# EAGLE design tick-mini-mk-4.2 (EAGLE 6.5.0)
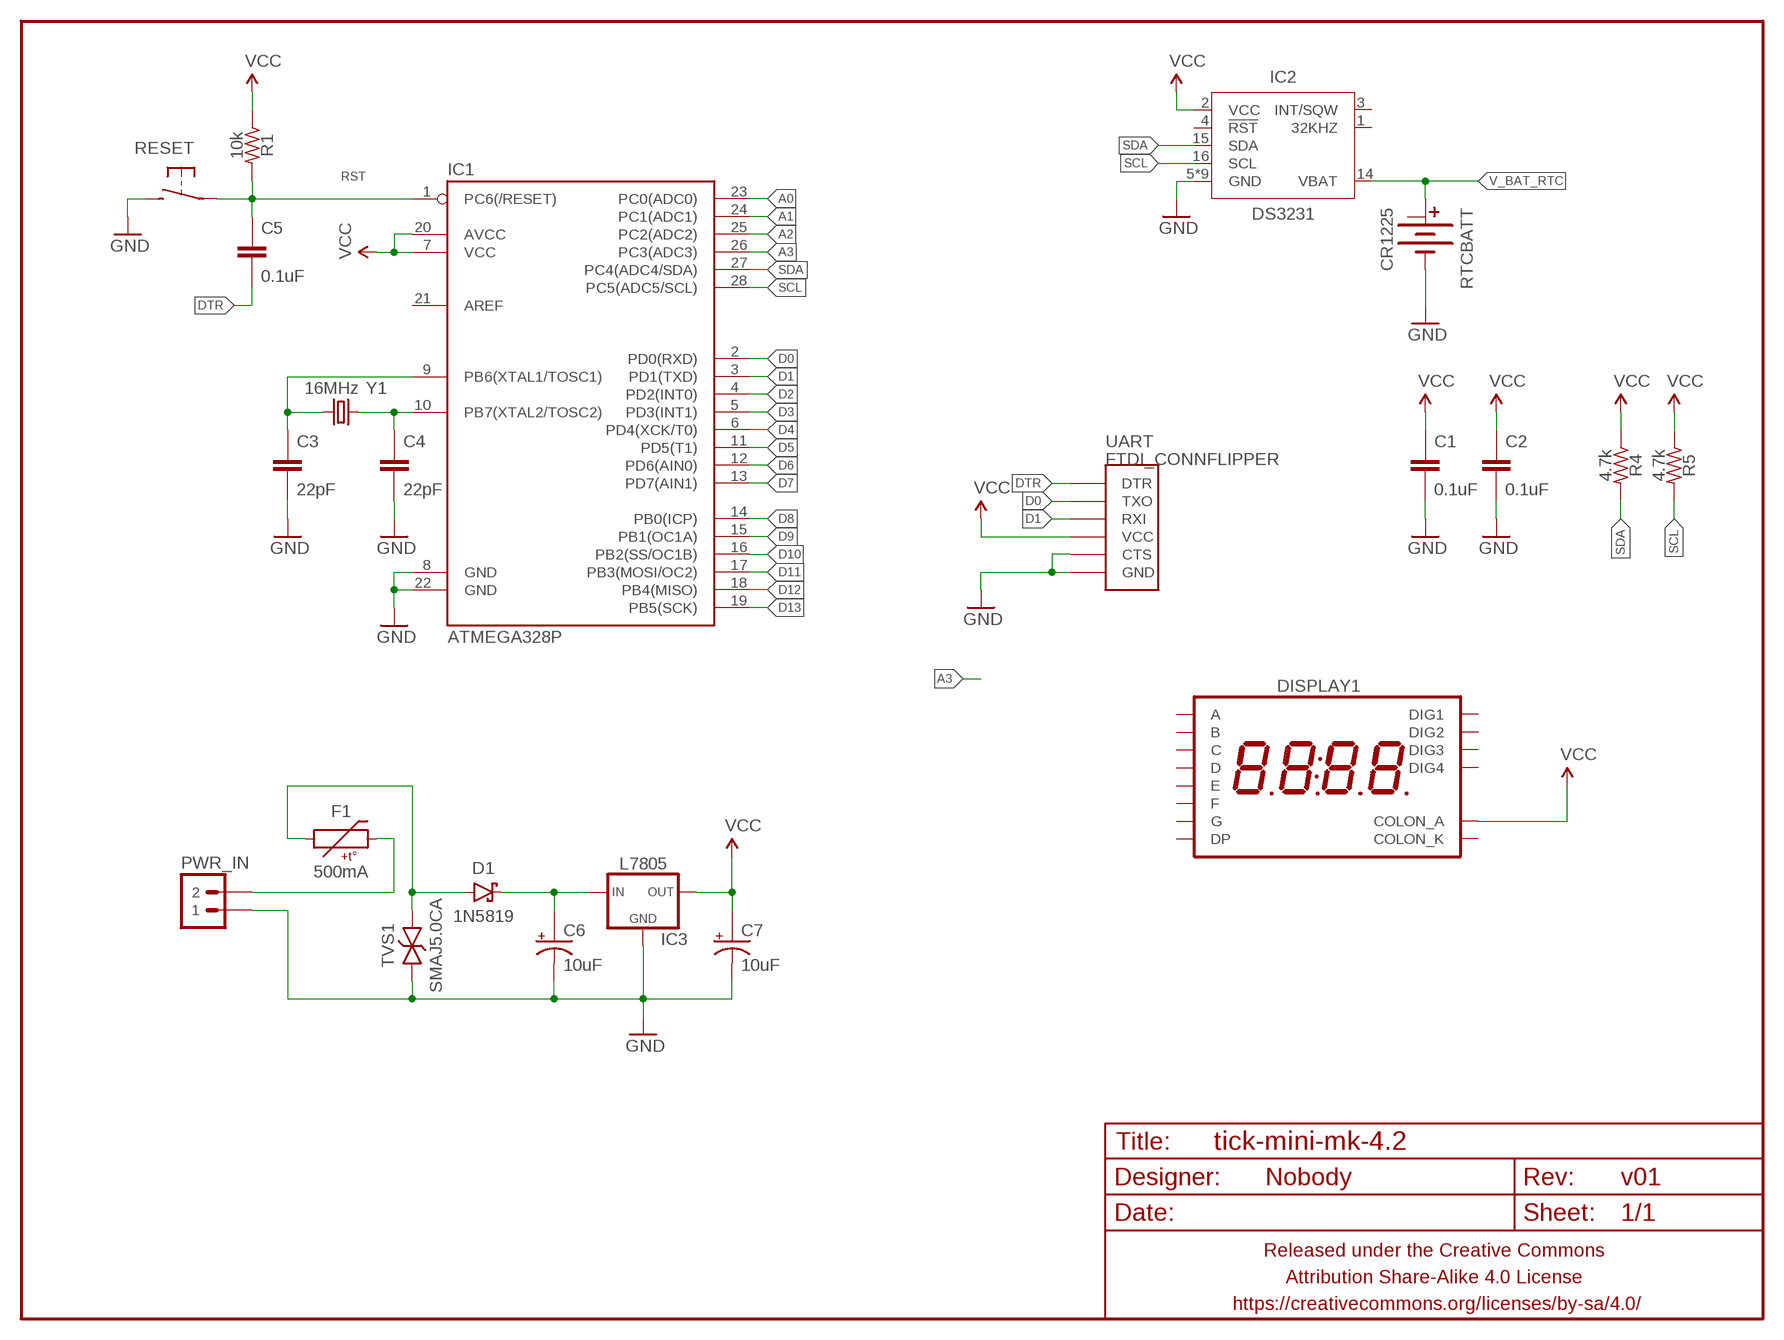
[diagram p0: schematic, sheet 1]

## Parts
C1  0.1uF  CAPACITOR-CERAMIC025-024X044  [C025-024X044]
C2  0.1uF  CAPACITOR-CERAMIC025-024X044  [C025-024X044]
C3  22pF  CAPACITOR-CERAMIC025-024X044  [C025-024X044]
C4  22pF  CAPACITOR-CERAMIC025-024X044  [C025-024X044]
C5  0.1uF  CAPACITOR-CERAMIC025-024X044  [C025-024X044]
C6  10uF  CAPACITOR-POLARIZEDE2-5  [E2-5]
C7  10uF  CAPACITOR-POLARIZEDE2-5  [E2-5]
D1  1N5819  DIODE-SCHOTTKYPTH-10.16MM  [DIODE-10.16MM]
DISPLAY1  7SEG_4DIGIT_COLON14.2MM-CC-NS  [7SEG_4DIG_NS]
F1  500mA  PTCPTH-5.08MM  [PTC-PTH-5.08MM]
FRAME1  FRAME-LETTERNO_PACKAGE  [DUMMY]
IC1  ATMEGA328P  ATMEGA328P_PDIP  [DIL28-3]
IC2  DS3231  [SO16W]
IC3  L7805  V_REG_78XXTO-92-INLINE  [TO-92-AMMO]
PWR_IN  M02JST-PTH-RA-R+  [JST-2-PH-RA-PTH-R+]
R1  10k  RESISTORPTH-AXIAL-5.08MM  [RESISTOR-AXIAL-PTH-5.08MM]
R4  4.7k  RESISTORPTH-AXIAL-5.08MM  [RESISTOR-AXIAL-PTH-5.08MM]
R5  4.7k  RESISTORPTH-AXIAL-5.08MM  [RESISTOR-AXIAL-PTH-5.08MM]
RESET  SPST-NO-TACT3MM-PTH-SMALL-PADS  [DTS-3-SMALL-PADS]
RTCBATT  CR1225  BATTERY-COINCR1225_SMD_SMALLER  [BATTCON_12MM_SMD]
TVS1  SMAJ5.0CA  TVSDO-41-10.16MM  [DO-41-TVS-BI-10.16MM]
UART  FTDI_CONNFLIPPER  [FTDI_CONN_FLIP]
Y1  16MHz  CRYSTALHC49UV  [HC49U-V]

## Nets
A0: IC1.23(PC0(ADC0))
A1: IC1.24(PC1(ADC1))
A2: IC1.25(PC2(ADC2))
A3: IC1.26(PC3(ADC3))
D0: IC1.2(PD0(RXD)) UART.TXO
D1: IC1.3(PD1(TXD)) UART.RXI
D2: IC1.4(PD2(INT0))
D3: IC1.5(PD3(INT1))
D4: IC1.6(PD4(XCK/T0))
D5: IC1.11(PD5(T1))
D6: IC1.12(PD6(AIN0))
D7: IC1.13(PD7(AIN1))
D8: IC1.14(PB0(ICP))
D9: IC1.15(PB1(OC1A))
D10: IC1.16(PB2(SS/OC1B))
D11: IC1.17(PB3(MOSI/OC2))
D12: IC1.18(PB4(MISO))
D13: IC1.19(PB5(SCK))
DTR: C5.2 UART.DTR
GND: C1.2 C2.2 C3.2 C4.2 C6.- C7.- IC1.8(GND) IC1.22(GND) IC2.5(GND) IC2.6(GND) IC2.7(GND) IC2.8(GND) IC2.9(GND) IC2.10(GND) IC2.11(GND) IC2.12(GND) IC2.13(GND) IC3.2(GND) PWR_IN.1 RESET.2 RTCBATT.- TVS1.P$1 UART.CTS UART.GND
N$1: C4.1 IC1.10(PB7(XTAL2/TOSC2)) Y1.1
N$2: C3.1 IC1.9(PB6(XTAL1/TOSC1)) Y1.2
N$3: D1.A F1.P$1 TVS1.P$2
N$5: F1.P$2 PWR_IN.2
N$8: C6.+ D1.C IC3.1(IN)
RST: C5.1 IC1.1(PC6(/RESET)) R1.P$2 RESET.1
SCL: IC1.28(PC5(ADC5/SCL)) IC2.16(SCL) R5.P$2
SDA: IC1.27(PC4(ADC4/SDA)) IC2.15(SDA) R4.P$2
V_BAT_RTC: IC2.14(VBAT) RTCBATT.+@1(+)
VCC: C1.1 C2.1 C7.+ DISPLAY1.P$8(COLON_A) IC1.7(VCC) IC1.20(AVCC) IC2.2(VCC) IC3.3(OUT) R1.P$1 R4.P$1 R5.P$1 UART.VCC
Unconnected: DISPLAY1.P$1(E) DISPLAY1.P$2(D) DISPLAY1.P$3(DP) DISPLAY1.P$4(C) DISPLAY1.P$5(G) DISPLAY1.P$6(DIG4) DISPLAY1.P$7(COLON_K) DISPLAY1.P$9(B) DISPLAY1.P$10(DIG3) DISPLAY1.P$11(DIG2) DISPLAY1.P$12(F) DISPLAY1.P$13(A) DISPLAY1.P$14(DIG1) IC1.21(AREF) IC2.1(32KHZ) IC2.3(INT/SQW) IC2.4(!RST) RTCBATT.+@2(+1)

## Library data of the parts
C1-C5 = A_butts:CAPACITOR-CERAMIC: CAPACITOR, European symbol
C6 C7 = A_butts:CAPACITOR-POLARIZED: POLARIZED CAPACITOR, American symbol
D1 = A_butts:DIODE-SCHOTTKY: Schottky diodes in SFE's production catalog BAT20J 1A 23V 0.62Vf RB751 120mA 40V 0.37Vf PMEG4005EJ 0.5A 40V 0.42Vf MBRA140 1A 40V 0.5Vf B340A 3A 40V SMA
DISPLAY1 = A_butts:7SEG_4DIGIT_COLON
F1 = A_butts:PTC: Resettable Fuse PTC Resettable Fuse. Spark Fun Electronics SKU : COM-08357
FRAME1 = A_butts:FRAME-LETTER: Schematic Frame Standard 8.5x11 US Letter frame; DESIGNER: Nobody; VERSION: v01
IC1 = A_butts:ATMEGA328P_PDIP: uC used in the Arduino 32kb flash, 1k EEPROM, 2k SRAM This is the through-hole version of this chip.
IC2 = A_butts:DS3231
IC3 = A_butts:V_REG_78XX: Voltage Regulator Standard 7805 5V regulator. IGO (Input Ground Output). Spark Fun Electronics SKU : COM-00107
PWR_IN = A_butts:M02: Standard 2-pin 0.1" header. Use with - straight break away headers ( PRT-00116) - right angle break away headers (PRT-00553) - swiss pins (PRT-00743) - machine pins (PRT-00117) - female headers (PRT-00115) Molex polarized connector foot print use with: PRT-08233 with associated crimp pins and housings. 2.54_SCREWTERM for use with PRT-10571. 3.5mm Screw Terminal footprints for PRT-08084 5mm Screw Terminal footprints for use with PRT-08433
R1 R4 R5 = A_butts:RESISTOR: RESISTOR, American symbol
RESET = A_butts:SPST-NO-TACT
RTCBATT = A_butts:BATTERY-COIN
TVS1 = A_butts:TVS: Transient voltage suppressor- prevents ESD on inputs. Ignore package description- MBRA140 is NOT this type of part!!!
UART = A_butts:FTDI_CONN: Connector which mates to FTDI basic or FTDI cable.
Y1 = A_butts:CRYSTAL: Various standard crystals. Proven footprints. Spark Fun Electronics SKU : COM-00534

## Board
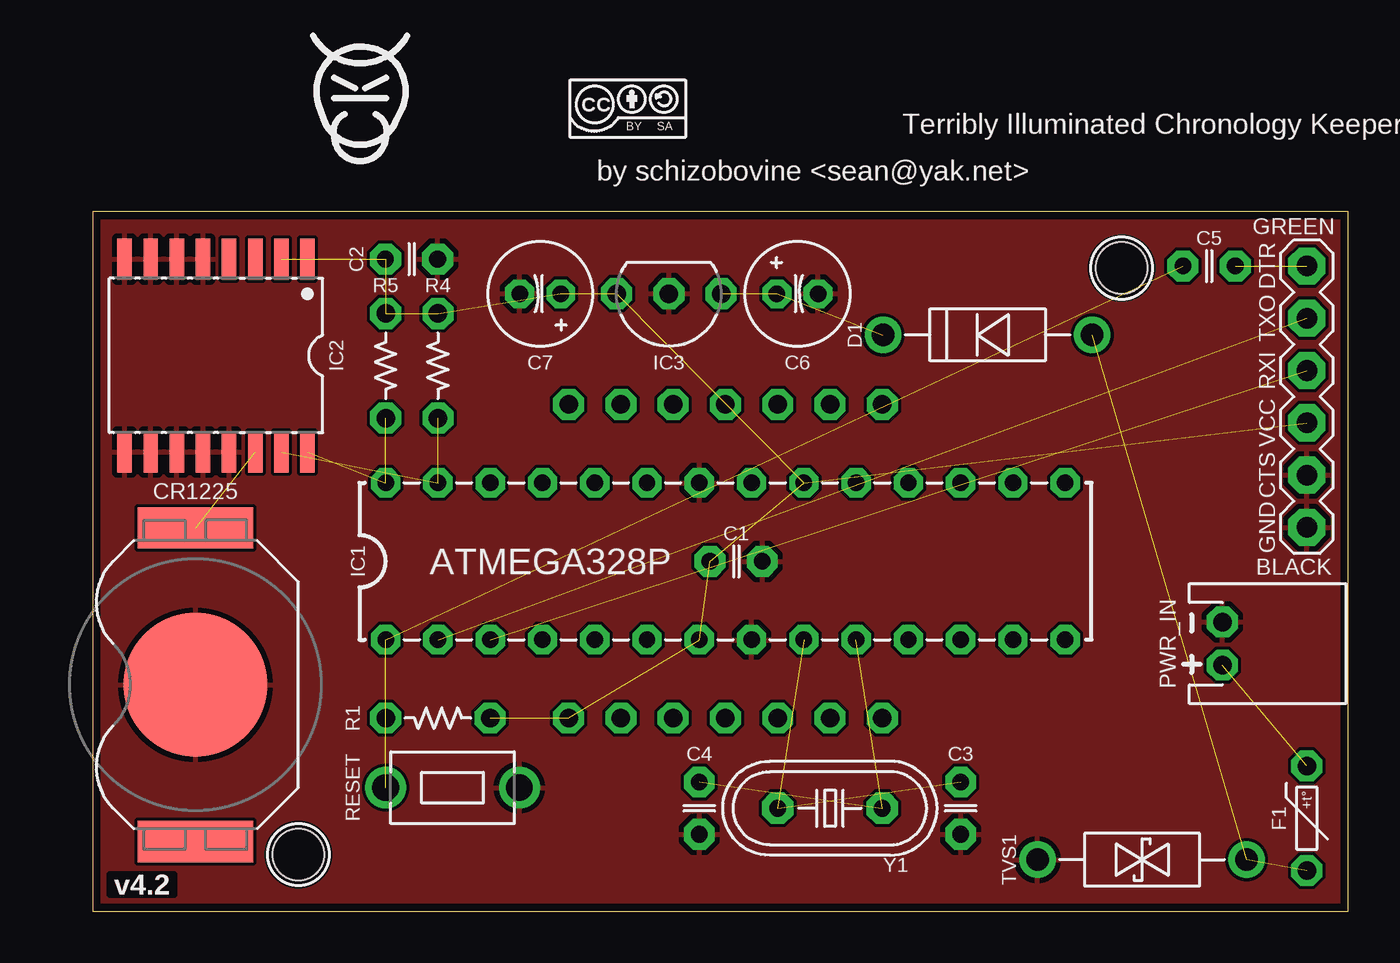
[diagram p1: board, top side]
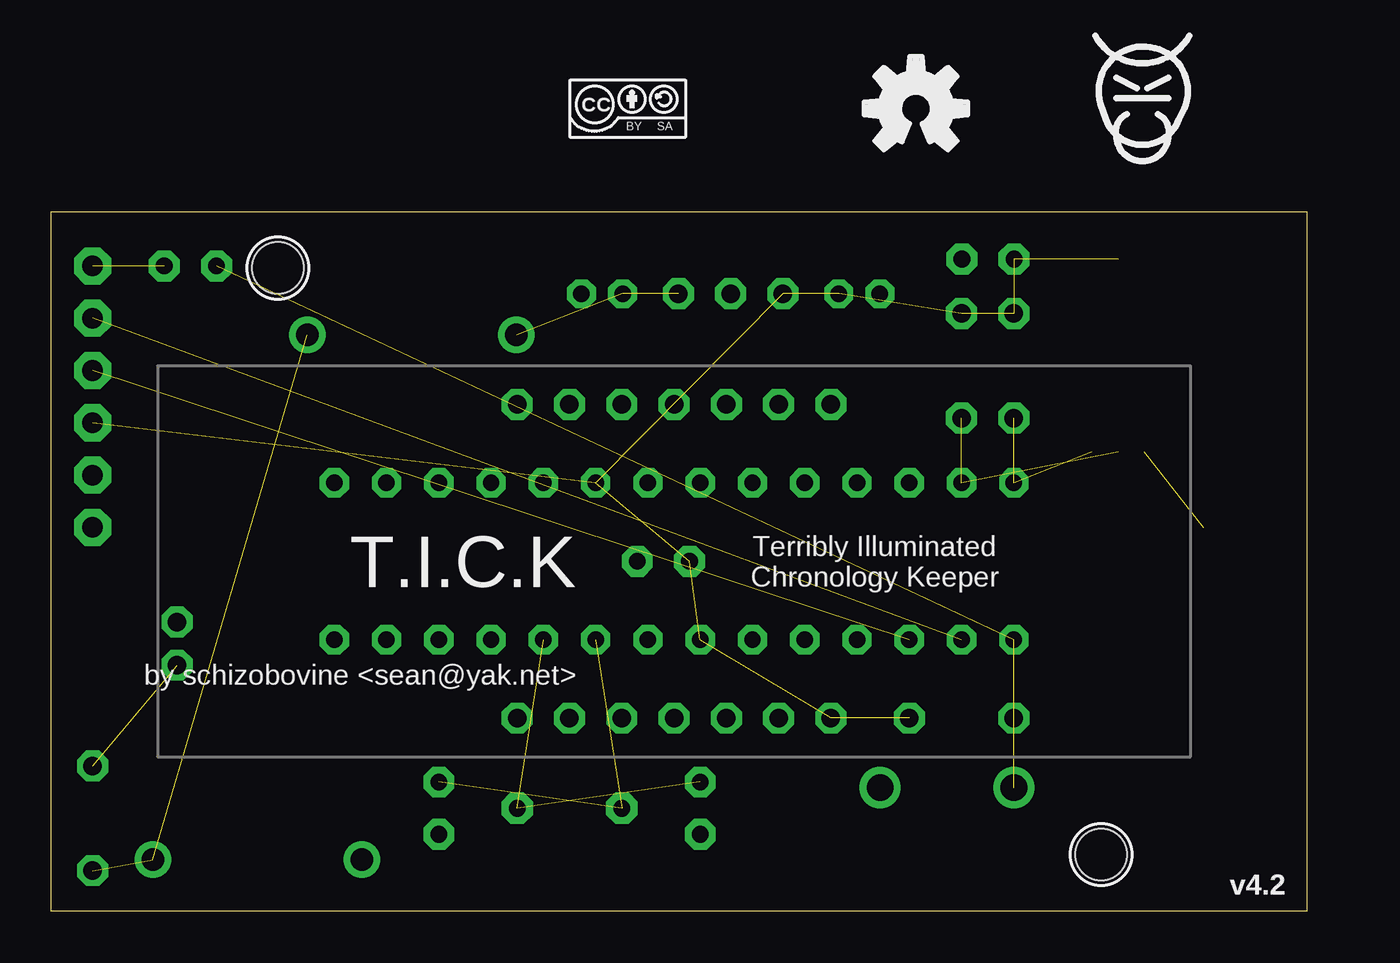
[diagram p2: board, bottom side, seen from below]

Size 61 x 34 mm. Coordinates in mm from the lower left corner, seen from the top.
Outline: 61,34 0,34 0,0 61,0 61,34
Copper layers (1*16): Top 0.0356mm / dielectric 1.5011mm / Bottom 0.0356mm
Design rules "LaenPCBOrder_2": minimum track width 6mil, minimum drill 13mil, track to track 6mil, track to pad 6mil, pad to pad 6mil, via to via 6mil, smd to smd 6mil, copper to edge 15mil, drill to drill 6mil, minimum pad ring 7mil, minimum via ring 7mil, stop-mask expansion 3mil, vias tented up to drill 20mil, thermal gap 10mil
Holes 2.5 mm at 50,31.25 10,2.75

### Footprints (pad centres in the part's own frame; a part is rotated, then mirrored left to right if it is on the bottom)
C025-024X044 = drill 0.813 pad 1.5 octagon: 1 -1.27,0; 2 1.27,0
E2-5 = drill 0.8 pad 1.4 octagon: + -1,0; - 1,0
DIODE-10.16MM = drill 1.1 pad 1.778: A -5.08,0; C 5.08,0
7SEG_4DIG_NS = drill 0.9 pad 1.5 octagon: P$1 -7.62,7.62; P$2 -5.08,7.62; P$3 -2.54,7.62; P$4 0,7.62; P$5 2.54,7.62; P$6 5.08,7.62; P$7 7.62,7.62; P$8 7.62,-7.62; P$9 5.08,-7.62; P$10 2.54,-7.62; P$11 0,-7.62; P$12 -2.54,-7.62; P$13 -5.08,-7.62; P$14 -7.62,-7.62
PTC-PTH-5.08MM = drill 0.9 pad 1.5 octagon: P$1 -2.54,0; P$2 2.54,0
DIL28-3 = drill 0.8 pad 1.422 octagon: 1 -16.51,-3.81; 2 -13.97,-3.81; 3 -11.43,-3.81; 4 -8.89,-3.81; 5 -6.35,-3.81; 6 -3.81,-3.81; 7 -1.27,-3.81; 8 1.27,-3.81; 9 3.81,-3.81; 10 6.35,-3.81; 11 8.89,-3.81; 12 11.43,-3.81; 13 13.97,-3.81; 14 16.51,-3.81; 15 16.51,3.81; 16 13.97,3.81; 17 11.43,3.81; 18 8.89,3.81; 19 6.35,3.81; 20 3.81,3.81; 21 1.27,3.81; 22 -1.27,3.81; 23 -3.81,3.81; 24 -6.35,3.81; 25 -8.89,3.81; 26 -11.43,3.81; 27 -13.97,3.81; 28 -16.51,3.81
SO16W = smd 0.7 x 2: 1 -4.445,-4.685; 2 -3.175,-4.685; 3 -1.905,-4.685; 4 -0.635,-4.685; 5 0.635,-4.685; 6 1.905,-4.685; 7 3.175,-4.685; 8 4.445,-4.685; 9 4.445,4.685; 10 3.175,4.685; 11 1.905,4.685; 12 0.635,4.685; 13 -0.635,4.685; 14 -1.905,4.685; 15 -3.175,4.685; 16 -4.445,4.685
TO-92-AMMO = drill 0.9 pad 1.5 octagon: 1 -2.54,0; 2 0,0; 3 2.54,0
JST-2-PH-RA-PTH-R+ = drill 0.9 pad 1.5 octagon: 1 -1.05,0; 2 1.05,0
RESISTOR-AXIAL-PTH-5.08MM = drill 0.9 pad 1.5 octagon: P$1 -2.54,0; P$2 2.54,0
DTS-3-SMALL-PADS = drill 1.3 pad 2: 1 -3.25,0; 2 3.25,0
BATTCON_12MM_SMD = smd 2 x 5.6: +@1 -7.62,0; +@2 7.62,0 | smd 7 x 7: - 0,0
DO-41-TVS-BI-10.16MM = drill 1.1 pad 1.778: P$1 -5.08,0; P$2 5.08,0
FTDI_CONN_FLIP = drill 1 pad 1.8 octagon: CTS 3.81,0; DTR -6.35,0; GND 6.35,0; RXI -1.27,0; TXO -3.81,0; VCC 1.27,0
HC49U-V = drill 0.813 pad 1.524 octagon: 1 -2.54,0; 2 2.54,0

### Placement (x,y rotation side)
C1  31.27,17 0 top
C2  15.5,31.68 0 top
C3  42.18,5 270 top
C4  29.48,5 270 top
C5  54.25,31.35 0 top
C6  34.25,30 0 top
C7  21.75,30 180 top
D1  43.49,28 180 top
DISPLAY1  30.75,17 0 bottom
F1  59,4.51 90 top
FRAME1  0,0 0 top
IC1  30.75,17 0 top
IC2  6,27 180 top
IC3  28,30 180 top
PWR_IN  54.9,13 270 top
R1  16.78,9.38 180 top
R4  16.78,26.5 270 top
R5  14.24,26.5 270 top
RESET  17.49,6 0 top
RTCBATT  5,11 270 top
TVS1  50.99,2.5 0 top
U$1  [CC-BY-SA-4.0-NO-URL]  33,39 0 bottom  (outside the outline)
U$2  [COW_SMALL_METAL_NOTEXT]  13,40 0 top  (outside the outline)
U$3  [OSHWLOGO_TOP_0.2]  19,39 0 bottom  (outside the outline)
U$4  [COW_SMALL_METAL_NOTEXT]  8,40 0 bottom  (outside the outline)
U$5  [CC-BY-SA-4.0-NO-URL]  26,39 0 top  (outside the outline)
UART  59,25 270 top
Y1  35.83,5 180 top

### Tracks (layer width: path | path; a pad name or v marks a point on that pad's centre or on a via)
D0  (1 unrouted)
D1  (1 unrouted)
DTR  (1 unrouted)
GND
  pour Top: -0.1,34.1 61.1,34.1 61.1,-0.1 -0.1,-0.1
N$1  (2 unrouted)
N$2  (2 unrouted)
N$3  (2 unrouted)
N$5  (1 unrouted)
N$8  (2 unrouted)
RST  (3 unrouted)
SCL  (2 unrouted)
SDA  (2 unrouted)
V_BAT_RTC  (1 unrouted)
VCC  (11 unrouted)

### Text on the board
tPlace: Terribly Illuminated Chronology Keeper | by schizobovine <sean@yak.net>
bPlace: Terribly Illuminated / Chronology Keeper | T.I.C.K | by schizobovine <sean@yak.net>